# Altium schematic sheet MCU089A_Connectors.SchDoc
size 431 x 279 mm; Date: Not shown in title block; ApprovedBy: Not shown in title block; CheckedBy: Not shown in title block; Author: Not shown in title block; CompanyName: Not shown in title block; Engineer: Not shown in title block; Organization: Not shown in title block; Address1: Not shown in title block; Address2: Not shown in title block; Address3: Not shown in title block; Address4: Not shown in title block; DocumentNumber: 2; Revision: Use project parameter SCH_Rev; SheetNumber: 2; SheetTotal: 8; PageSetup: Record=PageOptions|CenterHorizontal=True|CenterVertical=True|PrintScale=1.00|XCorrection=1.00|YCorrection=1.00|PrintKind=0|BorderSize=5000000|LeftOffset=0|BottomOffset=0|Orientation=2|PaperLength=1000|PaperWidth=1000|Scale=100|PaperSource=15|PrintQuality=600|MediaType=1|DitherType=10|PaperKind=Letter|PrintScaleMode=1; CurrentTime: Not shown in title block; CurrentDate: Not shown in title block; Time: Not shown in title block; DocumentFullPathAndName: Not shown in title block; DocumentName: Not shown in title block; ModifiedDate: Not shown in title block; ImagePath: Not shown in title block
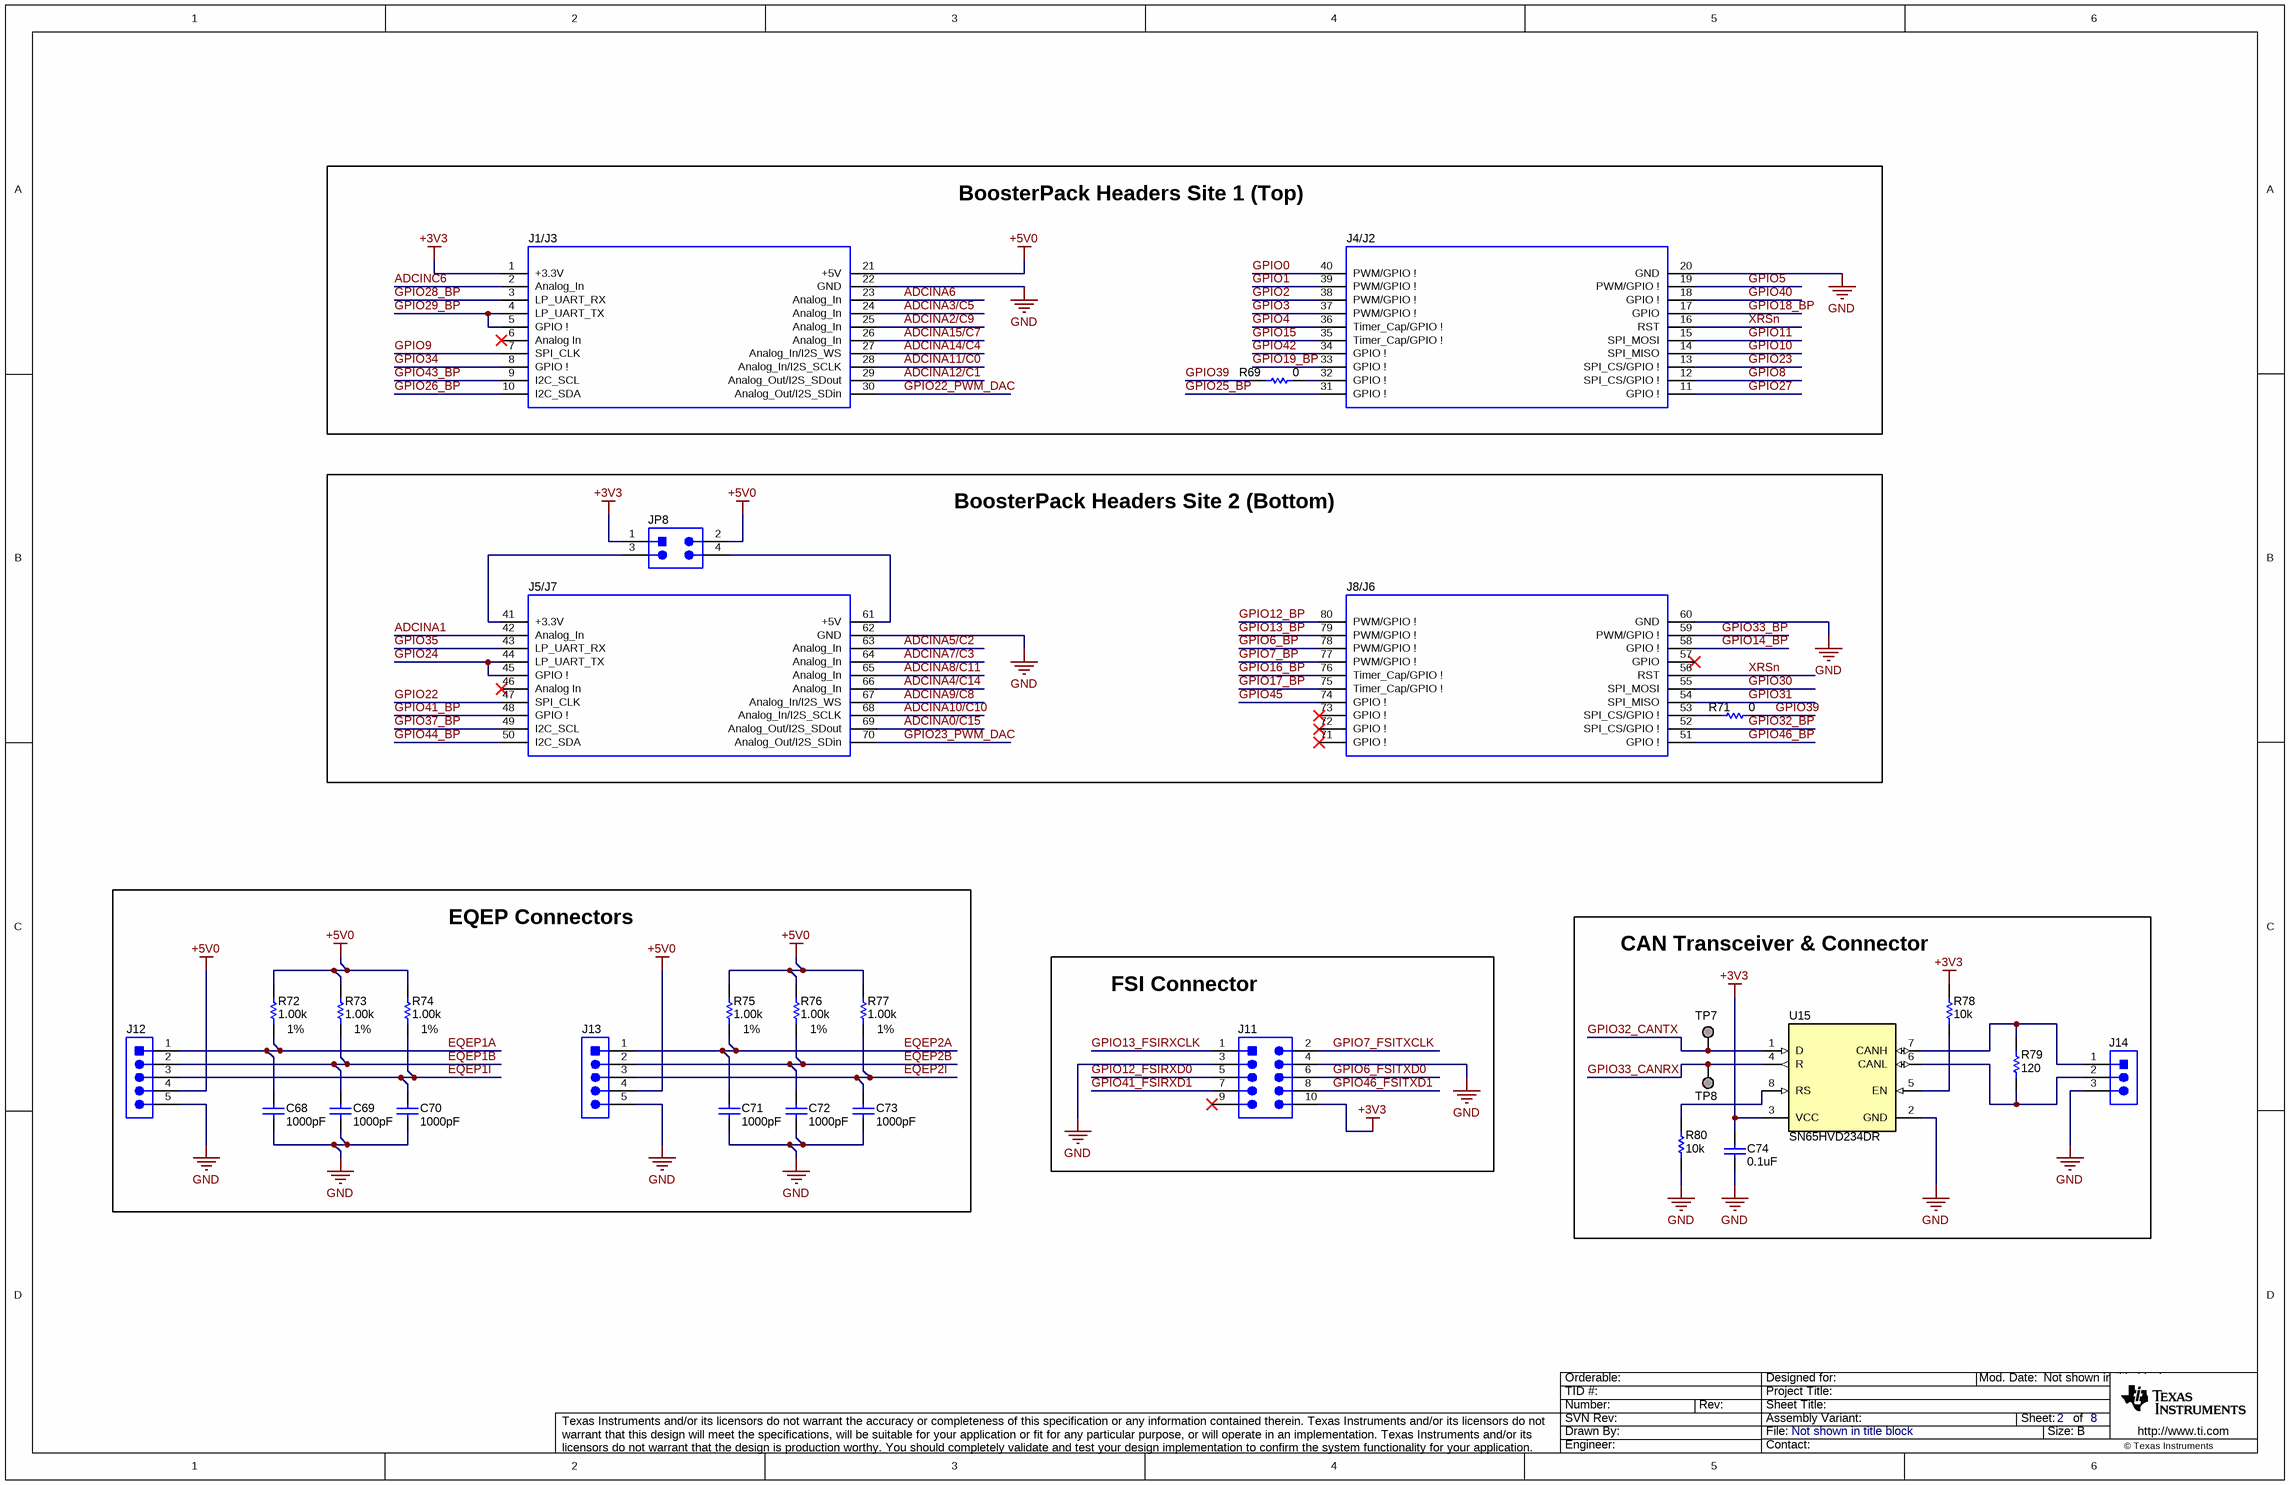
[diagram p0: MCU089A_Connectors.SchDoc]

## Parts
C68  ValueDisplayed: 1000pF  [0402]  (hidden comment: 885012205061)
C69  ValueDisplayed: 1000pF  [0402]  (hidden comment: 885012205061)
C70  ValueDisplayed: 1000pF  [0402]  (hidden comment: 885012205061)
C71  ValueDisplayed: 1000pF  [0402]  (hidden comment: 885012205061)
C72  ValueDisplayed: 1000pF  [0402]  (hidden comment: 885012205061)
C73  ValueDisplayed: 1000pF  [0402]  (hidden comment: 885012205061)
C74  ValueDisplayed: 0.1uF  [0402]  (hidden comment: GRM155R71A104KA01D)
J1/J3  SSQ-110-03-T-D  [BoosterPack_40pin_J1J3]  (value not drawn)
J4/J2  SSQ-110-03-T-D  [BoosterPack_40pin_J2J4]  (value not drawn)
J5/J7  SSQ-110-03-T-D  [BoosterPack_40pin_J5J7]  (value not drawn)
J8/J6  SSQ-110-03-T-D  [BoosterPack_40pin_J6J8]  (value not drawn)
J11  TSW-105-07-G-D  [TSW-105-07-G-D]  (value not drawn)
J12  TSW-105-07-G-S  [TSW-105-07-X-S]  (value not drawn)
J13  TSW-105-07-G-S  [TSW-105-07-X-S]  (value not drawn)
J14  61300311121  [WURTH_61300311121]  (value not drawn)
JP8  TSW-102-07-G-D  [TSW-102-07-G-D]  (value not drawn)
R69  ValueDisplayed: 0  [0603]  (hidden comment: CRCW06030000Z0EA)
R71  ValueDisplayed: 0  [0603]  (hidden comment: CRCW06030000Z0EA)
R72  ValueDisplayed: 1.00k  Value1: 1%  [0402]  (hidden comment: CRCW04021K00FKED)
R73  ValueDisplayed: 1.00k  Value1: 1%  [0402]  (hidden comment: CRCW04021K00FKED)
R74  ValueDisplayed: 1.00k  Value1: 1%  [0402]  (hidden comment: CRCW04021K00FKED)
R75  ValueDisplayed: 1.00k  Value1: 1%  [0402]  (hidden comment: CRCW04021K00FKED)
R76  ValueDisplayed: 1.00k  Value1: 1%  [0402]  (hidden comment: CRCW04021K00FKED)
R77  ValueDisplayed: 1.00k  Value1: 1%  [0402]  (hidden comment: CRCW04021K00FKED)
R78  ValueDisplayed: 10k  [0402]  (hidden comment: CRCW040210K0JNED)
R79  ValueDisplayed: 120  [0603]  (hidden comment: RC0603FR-07120RL)
R80  ValueDisplayed: 10k  [0402]  (hidden comment: CRCW040210K0JNED)
TP7  TESTPOINT  [TP_50MIL-25MILHOLE]  (value not drawn)  (no BOM)
TP8  TESTPOINT  [TP_50MIL-25MILHOLE]  (value not drawn)  (no BOM)
U15  SN65HVD234DR  [D0008A_L]

## Blocks framed on the sheet
BoosterPack Headers Site 1 (Top): J1/J3 J4/J2 R69
BoosterPack Headers Site 2 (Bottom): J5/J7 J8/J6 JP8 R71
EQEP Connectors: C68-C73 J12 J13 R72-R77
FSI Connector: J11
CAN Transceiver & Connector: C74 J14 R78-R80 TP7 TP8 U15

## Nets
+3V3: C74.2 J1/J3.1(+3.3V) J11.10 JP8.1 R78.2 U15.3(VCC)
+5V0: J1/J3.21(+5V) J12.4 J13.4 JP8.2 R72.2 R73.2 R74.2 R75.2 R76.2 R77.2
GND: C68.2 C69.2 C70.2 C71.2 C72.2 C73.2 C74.1 J1/J3.22(GND) J4/J2.20(GND) J5/J7.62(GND) J8/J6.60(GND) J11.3 J11.4 J12.5 J13.5 J14.3 R80.1 U15.2(GND)
ADCINA0/C15: J5/J7.69(Analog_Out/I2S_SDout)
ADCINA1: J5/J7.42(Analog_In)
ADCINA2/C9: J1/J3.25(Analog_In)
ADCINA3/C5: J1/J3.24(Analog_In)
ADCINA4/C14: J5/J7.66(Analog_In)
ADCINA5/C2: J5/J7.63(Analog_In)
ADCINA6: J1/J3.23(Analog_In)
ADCINA7/C3: J5/J7.64(Analog_In)
ADCINA8/C11: J5/J7.65(Analog_In)
ADCINA9/C8: J5/J7.67(Analog_In/I2S_WS)
ADCINA10/C10: J5/J7.68(Analog_In/I2S_SCLK)
ADCINA11/C0: J1/J3.28(Analog_In/I2S_SCLK)
ADCINA12/C1: J1/J3.29(Analog_Out/I2S_SDout)
ADCINA14/C4: J1/J3.27(Analog_In/I2S_WS)
ADCINA15/C7: J1/J3.26(Analog_In)
ADCINC6: J1/J3.2(Analog_In)
EQEP1A: C68.1 J12.1 R72.1
EQEP1B: C69.1 J12.2 R73.1
EQEP1I: C70.1 J12.3 R74.1
EQEP2A: C71.1 J13.1 R75.1
EQEP2B: C72.1 J13.2 R76.1
EQEP2I: C73.1 J13.3 R77.1
GPIO0: J4/J2.40(PWM/GPIO_!)
GPIO1: J4/J2.39(PWM/GPIO_!)
GPIO2: J4/J2.38(PWM/GPIO_!)
GPIO3: J4/J2.37(PWM/GPIO_!)
GPIO4: J4/J2.36(Timer_Cap/GPIO_!)
GPIO5: J4/J2.19(PWM/GPIO_!)
GPIO6_BP: J8/J6.78(PWM/GPIO_!)
GPIO6_FSITXD0: J11.6
GPIO7_BP: J8/J6.77(PWM/GPIO_!)
GPIO7_FSITXCLK: J11.2
GPIO8: J4/J2.12(SPI_CS/GPIO_!)
GPIO9: J1/J3.7(SPI_CLK)
GPIO10: J4/J2.14(SPI_MISO)
GPIO11: J4/J2.15(SPI_MOSI)
GPIO12_BP: J8/J6.80(PWM/GPIO_!)
GPIO12_FSIRXD0: J11.5
GPIO13_BP: J8/J6.79(PWM/GPIO_!)
GPIO13_FSIRXCLK: J11.1
GPIO14_BP: J8/J6.58(GPIO_!)
GPIO15: J4/J2.35(Timer_Cap/GPIO_!)
GPIO16_BP: J8/J6.76(Timer_Cap/GPIO_!)
GPIO17_BP: J8/J6.75(Timer_Cap/GPIO_!)
GPIO18_BP: J4/J2.17(GPIO)
GPIO19_BP: J4/J2.33(GPIO_!)
GPIO22: J5/J7.47(SPI_CLK)
GPIO22_PWM_DAC: J1/J3.30(Analog_Out/I2S_SDin)
GPIO23: J4/J2.13(SPI_CS/GPIO_!)
GPIO23_PWM_DAC: J5/J7.70(Analog_Out/I2S_SDin)
GPIO24: J5/J7.44(LP_UART_TX) J5/J7.45(GPIO_!)
GPIO25_BP: J4/J2.31(GPIO_!)
GPIO26_BP: J1/J3.10(I2C_SDA)
GPIO27: J4/J2.11(GPIO_!)
GPIO28_BP: J1/J3.3(LP_UART_RX)
GPIO29_BP: J1/J3.4(LP_UART_TX) J1/J3.5(GPIO_!)
GPIO30: J8/J6.55(SPI_MOSI)
GPIO31: J8/J6.54(SPI_MISO)
GPIO32_BP: J8/J6.52(SPI_CS/GPIO_!)
GPIO32_CANTX: TP7.1 U15.1(D)
GPIO33_BP: J8/J6.59(PWM/GPIO_!)
GPIO33_CANRX: TP8.1 U15.4(R)
GPIO34: J1/J3.8(GPIO_!)
GPIO35: J5/J7.43(LP_UART_RX)
GPIO37_BP: J5/J7.49(I2C_SCL)
GPIO39: R69.1 R71.2
GPIO40: J4/J2.18(GPIO_!)
GPIO41_BP: J5/J7.48(GPIO_!)
GPIO41_FSIRXD1: J11.7
GPIO42: J4/J2.34(GPIO_!)
GPIO43_BP: J1/J3.9(I2C_SCL)
GPIO44_BP: J5/J7.50(I2C_SDA)
GPIO45: J8/J6.74(GPIO_!)
GPIO46_BP: J8/J6.51(GPIO_!)
GPIO46_FSITXD1: J11.8
XRSn: J4/J2.16(RST) J8/J6.56(RST)
NetJ4/J2_32: J4/J2.32(GPIO_!) R69.2
NetJ5/J7_41: J5/J7.41(+3.3V) JP8.3
NetJ5/J7_61: J5/J7.61(+5V) JP8.4
NetJ8/J6_53: J8/J6.53(SPI_CS/GPIO_!) R71.1
NetJ14_1: J14.1 R79.2 U15.7(CANH)
NetJ14_2: J14.2 R79.1 U15.6(CANL)
NetR78_1: R78.1 U15.5(EN)
NetR80_2: R80.2 U15.8(RS)

Not connected (* = marked no-connect by the designer): J1/J3 6(Analog_In)*; J5/J7 46(Analog_In)*; J8/J6 57(GPIO)* 71(GPIO_!)* 72(GPIO_!)* 73(GPIO_!)*; J11 9*

## Notes on the sheet
- Drawn By:
- SVN Rev:
- Number:
- TID #:
- Orderable:
- Rev:
- Sheet Title:
- File:
- Project Title:
- Designed for:
- Assembly Variant:
- Mod. Date:
- Sheet:
- Size:
- of
- B
- http://www.ti.com
- Texas Instruments and/or its licensors do not warrant the accuracy or completeness of this specification or any information contained therein. Texas Instruments and/or its licensors do not warrant that this design will meet the specifications, will be suitable for your application or fit for any particular purpose, or will operate in an implementation. Texas Instruments and/or its licensors do not warrant that the design is production worthy. You should completely validate and test your design implementation to confirm the system functionality for your application.
- Engineer:
- Contact:
- © Texas Instruments

## Library data of the parts
C68-C73 = CMP-0006231-2: CAP, CERM, 1000 pF, 50 V, +/- 10%, X7R, 0402; Manufacturer: Wurth Elektronik; Polarized: N; Value: 1000pF; U/M: EA; Cap_F: 1nF; Value1: Unknown; VDC_V: 50V; TaMin_C: -55°C; TaMax_C: 125°C; SizeArea_mm2: 0.5; SizeAreaWB_mm2: 3; SizeX_mm: 1; SizeZ_mm: 0.6; AEC Category: Q200; CompType: Capacitor; PartNumber: 885012205061; PackageReference: 0402; RoHS: Y; Tolerance_%: 10%; Value2: 50V; MountType: SMT; Technology: Ceramic; TempCo: X7R; Cap_Case: 0402; SizeY_mm: 0.5; Published: 2008-06-19; Publisher: Texas Instruments; LatestRevisionDate: 2017-03-09; ComponentLink1Description: Datasheet link; ComponentLink1URL: http://katalog.we-online.de/pbs/datasheet/885012205061.pdf; Supplier 1: Digi-Key; Supplier Part Number 1: 732-7556-1-ND; Supplier 2: Mouser; Supplier Part Number 2: 710-885012205061; AEC Qualified: N; AEC Grade: N/A
C74 = CMP-0006629-2: CAP, CERM, 0.1 uF, 10 V, +/- 10%, X7R, 0402; Manufacturer: MuRata; Polarized: N; Value: 0.1uF; U/M: EA; Cap_F: 100nF; Value1: Unknown; VDC_V: 10V; TaMin_C: -55°C; TaMax_C: 125°C; SizeArea_mm2: 0.5; SizeAreaWB_mm2: 3; SizeX_mm: 1; SizeZ_mm: 0.6; AEC Category: Q200; CompType: Capacitor; PartNumber: GRM155R71A104KA01D; PackageReference: 0402; RoHS: Y; Tolerance_%: 10%; Value2: 10V; MountType: SMT; Technology: Ceramic; TempCo: X7R; Cap_Case: 0402; SizeY_mm: 0.5; Published: 2008-06-19; Publisher: Texas Instruments; LatestRevisionDate: 2017-03-09; ComponentLink1Description: Datasheet link; ComponentLink1URL: http://search.murata.co.jp/Ceramy/PnsearchViewAction.do?HnOFG=ON&HnNFG=ON&SEL_CNT=50&sLang=en&sKey=GRM155R71A104KA01D&x=9&y=9&search=startwith; Supplier 1: Digi-Key; Supplier Part Number 1: GRM155R71A104KA01D-ND; Supplier 2: Newark; Supplier Part Number 2: 14T3278; Supplier 3: Mouser; Supplier Part Number 3: 81-GRM155R71A104KA1D; AEC Qualified: ?
J1/J3 = CMP-0003837-4: Receptacle, 2.54mm, 10x2, Tin, TH; Alternate PartNumber: CRD-081413-A-G; Manufacturer: Samtec; Alternate Manufacturer: Major League Electronics; Note: Booster Pack 40 pin J1 and J3; Green_Lifecycle: Active; Green_REACh: Incomplete; Supplier 1: Digi-Key; CompType: Receptacle; PackageReference: 10x2 Receptacle; RoHS: Y; Supplier Part Number 1: SAM1204-10-ND; MountType: TH; PartNumber: SSQ-110-03-T-D; ComponentLink1Description: Datasheet Link; ComponentLink1URL: https://www.samtec.com/ftppub/cpdf/SSQ-1XX-XX-XXX-X-XX-XXX-XX-X-MKT.pdf; Supplier 2: Newark; Supplier Part Number 2: 11P8392; Green_EU RoHS: Passed; Green_EU RoHS-2: Passed
J4/J2 = CMP-0078266-4: Receptacle, 2.54mm, 10x2, Tin, TH; Alternate PartNumber: CRD-081413-A-G; Manufacturer: Samtec; Alternate Manufacturer: Major League Electronics; Note: Booster Pack 40 pin J2 and J4; Green_REACh: Incomplete; Green_Lifecycle: Active; Green_EU RoHS-2: Passed; CompType: Receptacle; Supplier 1: Digi-Key; PackageReference: 10x2 Receptacle; RoHS: Y; Supplier Part Number 1: SAM1204-10-ND; PartNumber: SSQ-110-03-T-D; MountType: TH; ComponentLink1Description: Datasheet Link; Green_EU RoHS: Passed; ComponentLink1URL: https://www.samtec.com/ftppub/cpdf/SSQ-1XX-XX-XXX-X-XX-XXX-XX-X-MKT.pdf; Supplier 2: Newark; Supplier Part Number 2: 11P8392
J5/J7 = CMP-0081070-3: Receptacle, 2.54mm, 10x2, Tin, TH; Alternate PartNumber: CRD-081413-A-G; Manufacturer: Samtec; Alternate Manufacturer: Major League Electronics; Note: Booster Pack 40 pin J5 and J7; Green_REACh: Incomplete; Green_Lifecycle: Active; ComponentLink1URL: https://www.samtec.com/ftppub/cpdf/SSQ-1XX-XX-XXX-X-XX-XXX-XX-X-MKT.pdf; Green_EU RoHS-2: Passed; CompType: Receptacle; Supplier 1: Digi-Key; PackageReference: 10x2 Receptacle; RoHS: Y; Supplier Part Number 1: SAM1204-10-ND; PartNumber: SSQ-110-03-T-D; MountType: TH; ComponentLink1Description: Datasheet Link; Green_EU RoHS: Passed
J8/J6 = CMP-0081071-3: Receptacle, 2.54mm, 10x2, Tin, TH; Alternate PartNumber: CRD-081413-A-G; Manufacturer: Samtec; Alternate Manufacturer: Major League Electronics; Note: Booster Pack 40 pin J6 and J8; Green_REACh: Incomplete; Green_Lifecycle: Active; ComponentLink1URL: https://www.samtec.com/ftppub/cpdf/SSQ-1XX-XX-XXX-X-XX-XXX-XX-X-MKT.pdf; Green_EU RoHS-2: Passed; CompType: Receptacle; Supplier 1: Digi-Key; PackageReference: 10x2 Receptacle; RoHS: Y; Supplier Part Number 1: SAM1204-10-ND; PartNumber: SSQ-110-03-T-D; MountType: TH; ComponentLink1Description: Datasheet Link; Green_EU RoHS: Passed
J11 = CMP-0075410-2: Header, 100mil, 5x2, Gold, TH; Manufacturer: Samtec; Pitch_mm: 2.54; Cert_VDE: N; Gender: Male; Cert_CSA: Y; Voltage_V: 550V; Green_REACh: Passed; Current_A: 6.3A; Green_Lifecycle: Active; Row_Count: 2; ComponentLink1Description: Datasheet URL; RoHS: Y; Supplier 1: Digi-Key; Cert_UL: Y; Orientation: Vertical; Green_EU RoHS: Passed; PackageReference: 5x2 Header; Color: Black; PartNumber: TSW-105-07-G-D; PinCount: 10; ContactFinish: Gold; Cert_CULUS: N; Shrouded: N; ClassName: Header; RowSpacing_mm: 2.54; ComponentLink1URL: http://samtec.com/ftppub/pdf/TSW_TH.PDF; CompType: Header; MountType: TH; Supplier Part Number 1: SAM1028-05-ND; Green_EU RoHS-2: Passed
J12 J13 = CMP-0075411-1: Header, 100mil, 5x1, Gold, TH; Manufacturer: Samtec; Pitch_mm: 2.54; Cert_VDE: N; Gender: Male; Cert_CSA: Y; Voltage_V: 550V; Green_REACh: Passed; Current_A: 6.3A; CT: False; Green_Lifecycle: Active; Row_Count: 1; CNHeader: True; ComponentLink1Description: Datasheet URL; RoHS: Y; Supplier 1: Digi-Key; Cert_UL: Y; Orientation: Vertical; Green_EU RoHS: Passed; PackageReference: 5x1 Header; Color: Black; PartNumber: TSW-105-07-G-S; PinCount: 5; Publisher: Texas Instruments; ContactFinish: Gold; Cert_CULUS: N; Shrouded: N; ClassName: Header; ComponentLink1URL: http://samtec.com/ftppub/pdf/TSW_TH.PDF; LatestRevisionDate: 2017-07-12; CompType: Header; MountType: TH; Supplier Part Number 1: SAM1029-05-ND; Green_EU RoHS-2: Passed
J14 = CMP-0054796-1: Header, 2.54 mm, 3x1, Gold, TH; Manufacturer: Wurth Elektronik; Green_Lifecycle: Active; Green_REACh: Passed; CNHeader: TRUE; CT: FALSE; PartNumber: 61300311121; PackageReference: Header, 2.54mm, 3x1, TH; ClassName: Header; CompType: Header; RoHS: Y; MountType: TH; ComponentLink1Description: Datasheet URL; ComponentLink1URL: http://katalog.we-online.de/em/datasheet/6130xx11121.pdf; Publisher: Texas Instruments; LatestRevisionDate: 26/05/2017; Supplier 1: Digi-Key; Supplier Part Number 1: 732-5316-ND; Supplier 2: Newark; Supplier Part Number 2: 20X0950; Supplier 3: Farnell; Supplier Part Number 3: 356154; Green_EU RoHS: Passed; Green_EU RoHS-2: Incomplete
JP8 = CMP-0075404-1: Header, 100mil, 2x2, Gold, TH; Manufacturer: Samtec; CNHeader: True; Shrouded: N; Gender: Male; Row_Count: 2; RowSpacing_mm: 2.54; CT: False; Cert_CSA: Y; Current_A: 6.3A; Green_Lifecycle: Active; Green_REACh: Passed; Voltage_V: 550V; ComponentLink1URL: http://samtec.com/ftppub/pdf/TSW_TH.PDF; ClassName: Header; Publisher: Texas Instruments; Color: Black; RoHS: Y; MountType: TH; Supplier 1: Digi-Key; PackageReference: 2x2 Header; PinCount: 4; CompType: Header; LatestRevisionDate: 2017-07-12; PartNumber: TSW-102-07-G-D; Orientation: Vertical; ComponentLink1Description: Datasheet URL; Supplier Part Number 1: SAM1028-02-ND; Pitch_mm: 2.54; ContactFinish: Gold; Cert_CULUS: N; Cert_UL: Y; Cert_VDE: N; Green_EU RoHS: Passed; Green_EU RoHS-2: Passed
R69 R71 = CMP-0025697-4: RES, 0, 5%, 0.1 W, AEC-Q200 Grade 0, 0603; Manufacturer: Vishay-Dale; Value: 0; Value_Code: 0000; Power_W: 100mW; Value2: 0.1W; VDC_V: 75V; TempCo: 200 ppm/C; SizeArea_mm2: 1.28; SizeX_mm: 1.6; SizeY_mm: 0.8; SizeZ_mm: 1; EIA_Code: E24; AEC Category: Q200; AEC Qualified: Y; CompType: Resistor; PartNumber: CRCW06030000Z0EA; PackageReference: 0603; RoHS: E; Res_ohm: 0; Tolerance_%: 5%; Value1: 5%; MountType: SMT; Technology: Thick Film; ComponentLink1Description: Datasheet link; ComponentLink1URL: http://www.vishay.com/docs/20035/dcrcwe3.pdf; Supplier 1: Digi-Key; Supplier Part Number 1: 541-0.0GCT-ND; Supplier 2: Newark; Supplier Part Number 2: 52K8014; Supplier 3: Mouser; Supplier Part Number 3: 71-CRCW0603-0-E3; AEC Grade: 0
R72-R77 = CMP-0026071-3: RES, 1.00 k, 1%, 0.063 W, AEC-Q200 Grade 0, 0402; Manufacturer: Vishay-Dale; Value: 1.00k; Res_ohm: 1k; Value_Code: 1k00; Power_W: 63mW; Value2: 0.063W; VDC_V: 50V; TempCo: 100 ppm/C; SizeArea_mm2: 0.5; SizeX_mm: 1; SizeZ_mm: 0.6; EIA_Code: E96; AEC Category: Q200; AEC Qualified: Y; AEC Grade: 0; CompType: Resistor; PartNumber: CRCW04021K00FKED; PackageReference: 0402; RoHS: E; Tolerance_%: 1%; MountType: SMT; Technology: Thick Film; SizeY_mm: 0.5; ComponentLink1Description: Datasheet link; ComponentLink1URL: http://www.vishay.com/docs/20035/dcrcwe3.pdf; Supplier 1: Digi-Key; Supplier Part Number 1: 541-1.00KLCT-ND; Supplier 2: Newark; Supplier Part Number 2: 52K6545; Supplier 3: Mouser; Supplier Part Number 3: 71-CRCW0402-1.0K-E3
R78 R80 = CMP-0026825-5: RES, 10 k, 5%, 0.063 W, AEC-Q200 Grade 0, 0402; Manufacturer: Vishay-Dale; Value: 10k; Value_Code: 10k0; Power_W: 63mW; Value2: 0.063W; VDC_V: 50V; TempCo: 200 ppm/C; SizeArea_mm2: 0.5; SizeX_mm: 1; SizeZ_mm: 0.6; EIA_Code: E24; AEC Category: Q200; AEC Qualified: Y; AEC Grade: 0; CompType: Resistor; PartNumber: CRCW040210K0JNED; PackageReference: 0402; RoHS: E; Res_ohm: 10k; Tolerance_%: 5%; Value1: 5%; MountType: SMT; Technology: Thick Film; SizeY_mm: 0.5; ComponentLink1Description: Datasheet link; ComponentLink1URL: http://www.vishay.com/docs/20035/dcrcwe3.pdf; Supplier 1: Digi-Key; Supplier Part Number 1: 541-10KJCT-ND; Supplier 2: Newark; Supplier Part Number 2: 59M6696; Supplier 3: Mouser; Supplier Part Number 3: 71-CRCW0402J-10K-E3
R79 = CMP-0022769-3: RES, 120, 1%, 0.1 W, 0603; Manufacturer: Yageo America; Value: 120; Value_Code: 120R; Power_W: 100mW; Value2: 0.1W; VDC_V: 150V; TempCo: 200 ppm/C; SizeArea_mm2: 1.28; SizeX_mm: 1.6; SizeY_mm: 0.8; SizeZ_mm: 1; U/M: EA; AEC Category: Q200; CompType: Resistor; PartNumber: RC0603FR-07120RL; PackageReference: 0603; RoHS: Y; Res_ohm: 120; Tolerance_%: 1%; Value1: 1%; MountType: SMT; Technology: Thick Film; Published: 2008-06-26; Publisher: Texas Instruments; LatestRevisionDate: 2017-03-09; ComponentLink1Description: Datasheet link; ComponentLink1URL: http://www.yageo.com/pdf/Pu-RC0603_51_PbFree_L_2.pdf; Supplier 1: Digi-Key; Supplier Part Number 1: 311-120HRCT-ND; Supplier 2: Mouser; Supplier Part Number 2: 603-RC0603FR-07120RL; Supplier 3: Farnell; Supplier Part Number 3: 9238379; AEC Qualified: ?
TP7 TP8 = CMP-0078143-3: TEST POINT.  No entry in BOM.; CompType: Testpoint; PackageReference: N/A; Manufacturer: N/A; PartNumber: N/A; Library Reference: TESTPOINT
U15 = CMP-0033355-1: 3.3V CAN Transceiver with Sleep Mode, 6 mA, -40 to 125 degC, 8-pin SOIC (D), Green (RoHS & no Sb/Br); Manufacturer: Texas Instruments; Drivers Per Package: 1; Bus Fault Voltage(V): +/-30; Transient Pulse Protection(V): -100 to 100; ICC(Max)(mA): 6; Supply Voltage(s)(V): 3.3; Rating: Catalog; DatasheetVersion: SLLS557F; PackageVersion: revM, Jun-2011; PackageReference: D0008A; PackageDescription: 8-Pin Plastic Small Outline Integrated Circuit, 4.9 x 3.9 mm, Pitch 1.27 mm Pitch; Eco-Plan: Green (RoHS & no Sb/Br); SubFamily: CAN; Receivers Per Package: 1; Isolated: No; Low Power Mode: Sleep; Footprint: PCA82C250, excludes pin5; PartNumber: SN65HVD234DR; Code_JEDEC: MS-012AA; ComponentLink1Description: Datasheet; ComponentLink1URL: http://www.ti.com/general/docs/lit/getliterature.tsp?genericPartNumber=SN65HVD234&fileType=pdf; Mounting Technology: Surface Mount